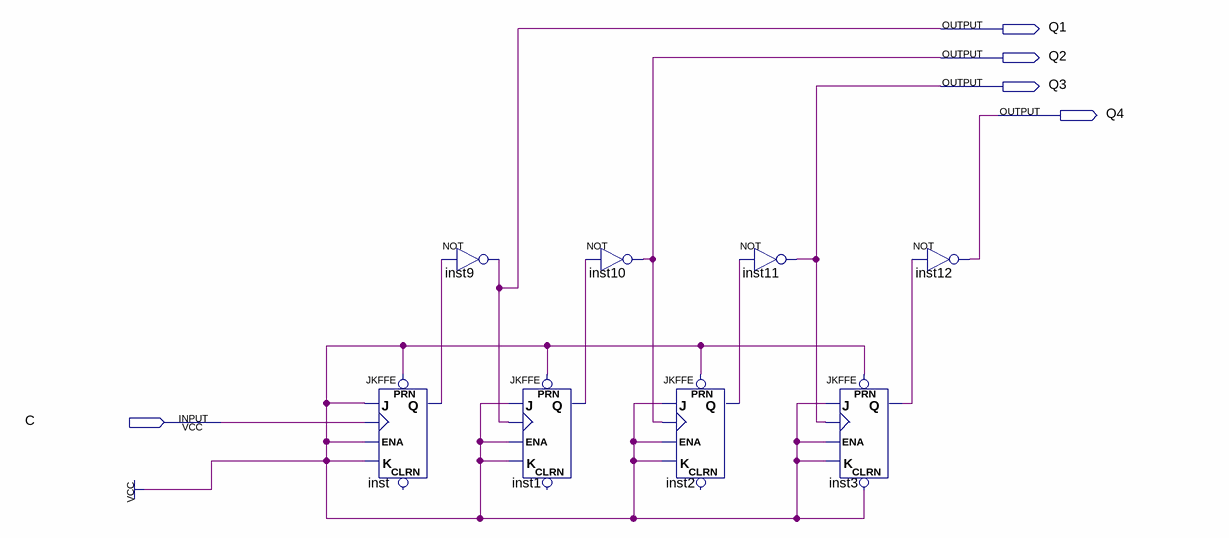
[diagram p0: schematic sheet]
// Quartus schematic lab6_2.bdf as structural Verilog: 8 symbols, 5 pins
module lab6_2 (
  input  C,
  output Q1,
  output Q2,
  output Q3,
  output Q4
);

  wire inst1_q, inst2_q, inst3_q, inst_q;

  JKFFE inst (.PRN(1'b1), .J(1'b1), .CLK(C), .K(1'b1), .ENA(1'b1), .Q(inst_q));  // open: CLRN
  not inst9 (Q1, inst_q);
  JKFFE inst1 (.PRN(1'b1), .J(1'b1), .CLK(Q1), .K(1'b1), .ENA(1'b1), .Q(inst1_q));  // open: CLRN
  not inst10 (Q2, inst1_q);
  JKFFE inst2 (.PRN(1'b1), .J(1'b1), .CLK(Q2), .K(1'b1), .ENA(1'b1), .Q(inst2_q));  // open: CLRN
  not inst11 (Q3, inst2_q);
  JKFFE inst3 (.PRN(1'b1), .J(1'b1), .CLK(Q3), .CLRN(1'b1), .K(1'b1), .ENA(1'b1), .Q(inst3_q));
  not inst12 (Q4, inst3_q);
endmodule
